# Altium schematic sheet Debugger.SchDoc
size A4; SheetNumber: 3; SheetTotal: 3
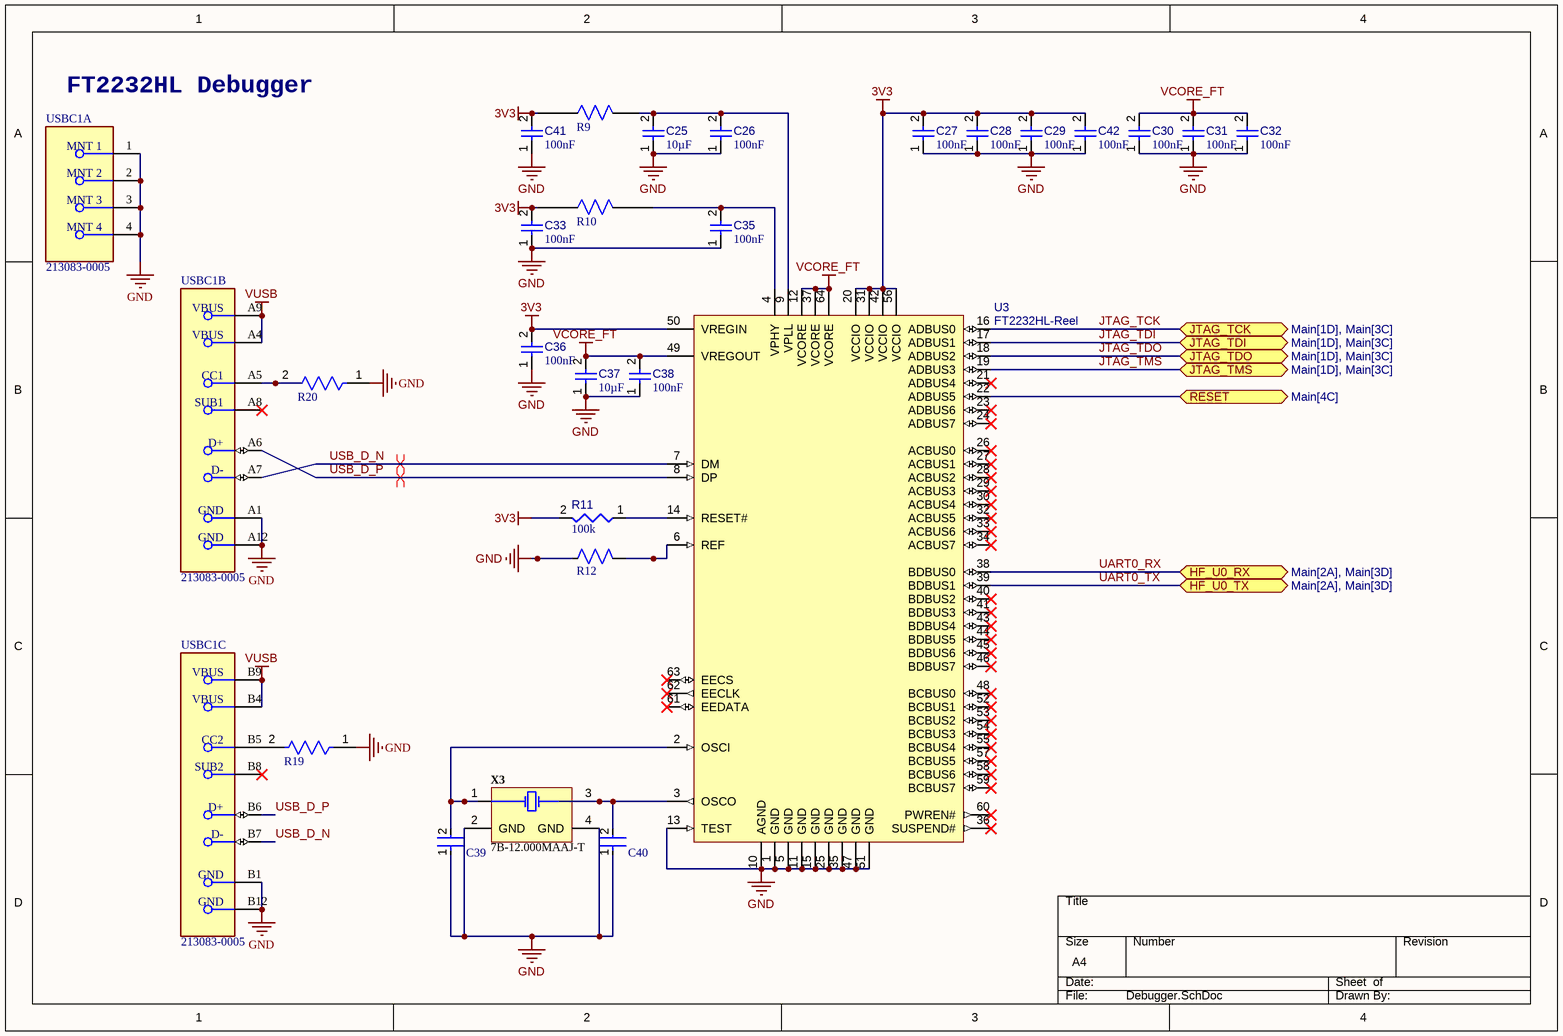
[diagram p0: Debugger.SchDoc]

## Parts
C25  value 10µF  [CAPC0603(1608)100_L]  (hidden comment: Capacitor 10µF +/-20% 10V 0603)
C26  value 100nF  [CAPC1608X90X40NL10T20]  (hidden comment: Capacitor 100 nF +/-10% 50 V 0603)
C27  value 100nF  [CAPC1608X90X40NL10T20]  (hidden comment: Capacitor 100 nF +/-10% 50 V 0603)
C28  value 100nF  [CAPC1608X90X40NL10T20]  (hidden comment: Capacitor 100 nF +/-10% 50 V 0603)
C29  value 100nF  [CAPC1608X90X40NL10T20]  (hidden comment: Capacitor 100 nF +/-10% 50 V 0603)
C30  value 100nF  [CAPC1608X90X40NL10T20]  (hidden comment: Capacitor 100 nF +/-10% 50 V 0603)
C31  value 100nF  [CAPC1608X90X40NL10T20]  (hidden comment: Capacitor 100 nF +/-10% 50 V 0603)
C32  value 100nF  [CAPC1608X90X40NL10T20]  (hidden comment: Capacitor 100 nF +/-10% 50 V 0603)
C33  value 100nF  [CAPC1608X90X40NL10T20]  (hidden comment: Capacitor 100 nF +/-10% 50 V 0603)
C35  value 100nF  [CAPC1608X90X40NL10T20]  (hidden comment: Capacitor 100 nF +/-10% 50 V 0603)
C36  value 100nF  [CAPC1608X90X40NL10T20]  (hidden comment: Capacitor 100 nF +/-10% 50 V 0603)
C37  value 10µF  [CAPC0603(1608)100_L]  (hidden comment: Capacitor 10µF +/-20% 10V 0603)
C38  value 100nF  [CAPC1608X90X40NL10T20]  (hidden comment: Capacitor 100 nF +/-10% 50 V 0603)
C39  06035A220JAT2A  [FP-0603-L_1_6_0_15-W_0_81-IPC_C]  (value not drawn)
C40  06035A220JAT2A  [FP-0603-L_1_6_0_15-W_0_81-IPC_C]  (value not drawn)
C41  value 100nF  [CAPC1608X90X40NL10T20]  (hidden comment: Capacitor 100 nF +/-10% 50 V 0603)
C42  value 100nF  [CAPC1608X90X40NL10T20]  (hidden comment: Capacitor 100 nF +/-10% 50 V 0603)
R9  PFC-W0603R-02-5R00-F  [PFC-W0603R-02-5R00-F-Footprint-1]  (value not drawn)
R10  PFC-W0603R-02-5R00-F  [PFC-W0603R-02-5R00-F-Footprint-1]  (value not drawn)
R11  value 100k  [RESC1608X55X25ML10T15]  (hidden comment: Resistor 100k +/-1% 0603 100 mW)
R12  CRG0603F12K  [CRG0603F12K-Footprint-1]  (value not drawn)
R19  CRCW06035K10JNEA  [FP-CRCW0603-e3-IPC_C]  (value not drawn)
R20  CRCW06035K10JNEA  [FP-CRCW0603-e3-IPC_C]  (value not drawn)
U3  FT2232HL-Reel  [LQFP-64_M]
USBC1  213083-0005  [FP-213083-0005-MFG]  (parts A,B,C of 3)
X3  7B-12.000MAAJ-T  [TXC-7B-4_V]

## Ports
HF_U0_RX (bidir, see Main[2A], Main[3D]), HF_U0_TX (bidir, see Main[2A], Main[3D]), JTAG_TCK (bidir, see Main[1D], Main[3C]), JTAG_TDI (bidir, see Main[1D], Main[3C]), JTAG_TDO (bidir, see Main[1D], Main[3C]), JTAG_TMS (bidir, see Main[1D], Main[3C]), RESET (bidir, see Main[4C])

## Nets
3V3: C27.2 C28.2 C29.2 C33.2 C36.2 C41.2 C42.2 R9.1 R10.1 R11.2 U3.20(VCCIO) U3.31(VCCIO) U3.42(VCCIO) U3.50(VREGIN) U3.56(VCCIO)
GND: C25.1 C26.1 C27.1 C28.1 C29.1 C30.1 C31.1 C32.1 C33.1 C35.1 C36.1 C37.1 C38.1 C39.1 C40.1 C41.1 C42.1 R12.1 R19.1 R20.1 U3.1(GND) U3.5(GND) U3.10(AGND) U3.11(GND) U3.13(TEST) U3.15(GND) U3.25(GND) U3.35(GND) U3.47(GND) U3.51(GND) USBC1.1(MNT_1) USBC1.2(MNT_2) USBC1.3(MNT_3) USBC1.4(MNT_4) USBC1.A1(GND) USBC1.A12(GND) USBC1.B1(GND) USBC1.B12(GND) X3.2(GND) X3.4(GND)
VCORE_FT: C30.2 C31.2 C32.2 C37.2 C38.2 U3.12(VCORE) U3.37(VCORE) U3.49(VREGOUT) U3.64(VCORE)
VUSB: USBC1.A4(VBUS) USBC1.A9(VBUS) USBC1.B4(VBUS) USBC1.B9(VBUS)
JTAG_TCK: U3.16(ADBUS0) ; port JTAG_TCK
JTAG_TDI: U3.17(ADBUS1) ; port JTAG_TDI
JTAG_TDO: U3.18(ADBUS2) ; port JTAG_TDO
JTAG_TMS: U3.19(ADBUS3) ; port JTAG_TMS
RESET: U3.22(ADBUS5) ; port RESET
UART0_RX: U3.38(BDBUS0) ; port HF_U0_RX
UART0_TX: U3.39(BDBUS1) ; port HF_U0_TX
USB_D_N: U3.7(DM) USBC1.A7(D-) USBC1.B7(D-)
USB_D_P: U3.8(DP) USBC1.A6(D+) USBC1.B6(D+)
NetC25_2: C25.2 C26.2 R9.2 U3.9(VPLL)
NetC35_2: C35.2 R10.2 U3.4(VPHY)
NetC39_2: C39.2 U3.2(OSCI) X3.1(X1)
NetC40_2: C40.2 U3.3(OSCO) X3.3(X2)
NetR11_1: R11.1 U3.14(RESET#)
NetR12_2: R12.2 U3.6(REF)
NetR19_2: R19.2 USBC1.B5(CC2)
NetR20_2: R20.2 USBC1.A5(CC1)

Not connected (* = marked no-connect by the designer): U3 21(ADBUS4)* 23(ADBUS6)* 24(ADBUS7)* 26(ACBUS0)* 27(ACBUS1)* 28(ACBUS2)* 29(ACBUS3)* 30(ACBUS4)* 32(ACBUS5)* 33(ACBUS6)* 34(ACBUS7)* 36(SUSPEND#)* 40(BDBUS2)* 41(BDBUS3)* 43(BDBUS4)* 44(BDBUS5)* 45(BDBUS6)* 46(BDBUS7)* 48(BCBUS0)* 52(BCBUS1)* 53(BCBUS2)* 54(BCBUS3)* 55(BCBUS4)* 57(BCBUS5)* 58(BCBUS6)* 59(BCBUS7)* 60(PWREN#)* 61(EEDATA)* 62(EECLK)* 63(EECS)*; USBC1 A8(SUB1)* B8(SUB2)*

## Layout directives
differential pair: USB_D_N, USB_D_P

## Notes on the sheet
- FT2232HL Debugger

## Library data of the parts
C25 C37 = CMP-001-00075-4: Chip Capacitor, 10µF +/-20%, 10V, 0603, Thickness 1 mm; Tolerance: 10%; Voltage Rating: 10V; Max Operating Temperature: 85°C; Pins: 2; Case/Package: 0603; Mounting Technology: SMT; Min Operating Temperature: -55°C
C26-C33 C35 C36 C38 C41 C42 = CMP-001-00017-6: Chip Capacitor, 100 nF, +/- 10%, 50 V, 0603 (1608 Metric); Voltage Rating: 50V; Capacitor Type: Ceramic; Tolerance: 10%; Mounting Technology: SM; Max Operating Temperature: 125°C; RoHS Compliant: True; Pins: 2; Case/Package: 0603; Min Operating Temperature: -55°C
C39 C40 = CMP-001-00085-1: 0603 22 pF 50V ±5% Tolerance C0G/NP0 Surface Mount Multilayer Ceramic Capacitor
R9 R10 = CMP-009-00178-1: 5 Ohm 1% 50PPM 1/10W
R11 = CMP-009-00023-5: Chip Resistor, 100 KOhm, +/- 1%, 0.1 W, -55 to 155 degC, 0603 (1608 Metric); Voltage Rating: 50V; Power: 100mW; Max Operating Temperature: 155°C; RoHS Compliant: True; Tolerance: 1%; Pins: 2; Case/Package: 0603; Mounting Technology: SM; Min Operating Temperature: -55°C
R12 = CMP-001-00089-1: Res Thick Film 0603 12K Ohm 1% 0.1W(1/10W) ±100ppm/C Pad SMD T/R
R19 R20 = CMP-009-00179-1: Res Thick Film 0603 5.1K Ohm 5% 1/10W ±200ppm/°C Molded SMD SMD Paper T/R
U3 = CMP-0078-00023-3: Dual High Speed USB To Multipurpose UART/FIFO IC, 64-pin LQFP, Tape and Reel; Manufacturer: FTDI; DatasheetVersion: ver 2.21, Jun-2012; ComponentLink1URL: http://www.ftdichip.com/; PartNumber: FT2232HL-Reel; ComponentLink2Description: Datasheet; RevisionNote: DatasheetVersion updated to 2.21 Jun-2012; PackageVersion: Jun-12; ComponentLink1Description: Manufacturer URL; ComponentLink2URL: http://www.ftdichip.com/Support/Documents/DataSheets/ICs/DS_FT2232H.pdf; PackageReference: LQFP-64; PackageDescription: 64-Pin Thin Quad Flat Pack, 10 x 10 x 1.4 mm Body, 0.5 mm Pitch
USBC1 = CMP-002-00073-2: Connector USB Type C Receptacle 16 Position 0.5mm Surface Mount Right Angle Emboss T/R
X3 = CMP-003-00007-2: SMD Seam Sealing Crystal, 12 MHz, +/- 30 ppm, 18 pF, -10 to 70 degC, 4-Pin SMD, RoHS, Tape and Reel; Manufacturer: TXC; Frequency: 12MHz; Tolerance: 30ppm; Resistance: 100Ohm; ESR: 40; Load Capacitance: 18pF; Package Quantity: 1; Pins: 4; Datasheet URL: http://www.txccorp.com/download/products/quartz_crystals/2015TXC_7B_19.pdf; Case/Package: 7B-4; Max Operating Temperature: 70°C; Packaging: TapeandReel; Package Description: 4-Pin Surface Mount Device, Body 5 x 3.2 mm, Pitch 3.7 mm; Frequency Tolerance: 30ppm; RoHS Compliant: True; Mounting Technology: SM; Package Reference: 7B-4; Min Operating Temperature: -20°C; Datasheet Version: Jul-15